# Altium schematic sheet SDP21_Daughter_Board_Schematic_REV1.SchDoc
size A4
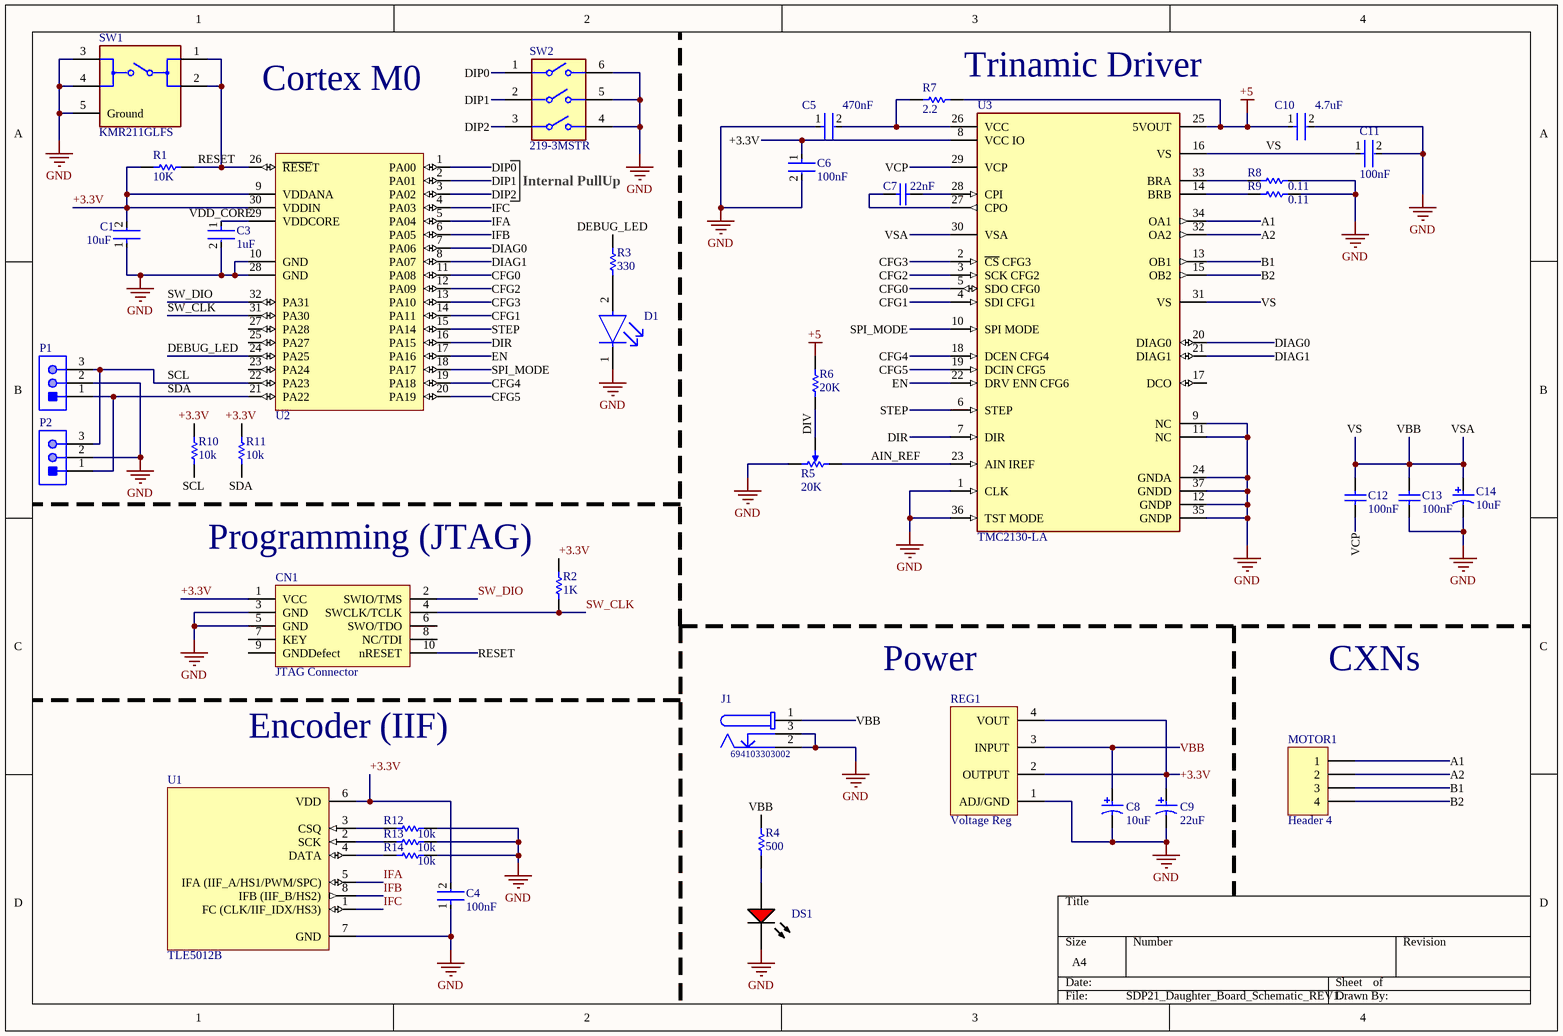
[diagram p0: SDP21_Daughter_Board_Schematic_REV1.SchDoc]

## Parts
C1  10uF  [FP-GRM188-0_1-e0_2_0_55-IPC_A]
C3  1uF  [FP-CC0603-DA-MFG]
C4  100nF  [FP-CGA3E-0_3-0_1-IPC_A]
C5  470nF  [FP-CC0603-DA-MFG]
C6  100nF  [FP-CGA3E-0_3-0_1-IPC_A]
C7  22nF  [CAPC1608X90X35ML10T15]
C8  10uF  [KEMT-A-3216-18-2_M]
C9  22uF  [AVX-TAJ-A-2_L]
C10  4.7uF  [FP-GRM188-0_15-IPC_C]
C11  100nF  [FP-CGA3E-0_3-0_1-IPC_A]
C12  100nF  [CAPC1608X90X35ML10T15]
C13  100nF  [CAPC1608X90X35ML10T15]
C14  10uF  [NIC-CAPA2-6.3X5.8_V]
CN1  JTAG Connector  [Header 5x2 - 50mil]
D1  APT1608LZGCK  [FP-APT1608LZGCK-MFG]  (value not drawn)
DS1  TLMS1100-GS08  [VISH-TLMX1100_V]  (value not drawn)
J1  694103303002  [694103303002]
MOTOR1  Header 4  [HDR1X4]
P1  B3B-PH-K-S(LF)(SN)  [JST-B3B-PH-K-S-3_V]  (value not drawn)
P2  B3B-PH-K-S(LF)(SN)  [JST-B3B-PH-K-S-3_V]  (value not drawn)
R1  10K  [RESC1609X55X30LL15T15]
R2  1K  [RESC1608X55X30LL20T20]
R3  330  [RESC1608X55X30ML15T15]
R4  500  [RESC1608X55X30ML15T15]
R5  20K  [BOUR-3313J-1_V]
R6  20K  [RESC1608X55X25LL10T15]
R7  2.2  [RESC1608X55X30ML15T15]
R8  0.11  [RESC3116X65X40ML10T20]
R9  0.11  [RESC3116X65X40ML10T20]
R10  10k  [RESC1608X55X30ML15T15]
R11  10k  [RESC1608X55X30ML15T15]
R12  10k  [RESC1608X55X30ML15T15]
R13  10k  [RESC1608X55X30ML15T15]
R14  10k  [RESC1608X55X30ML15T15]
REG1  Voltage Reg  [SOT223]
SW1  KMR211GLFS  [FP-KMR211GLFS-MFG]
SW2  219-3MSTR  [FP-219-3MSTR-MFG]
U1  TLE5012B  [PG-DSO-8]
U2  ATSAMD21E15B-AUT  [TQFP-32]  (value not drawn)
U3  TMC2130-LA  [FP-TMC2130-LA-IPC_C]

## Nets
+5: C10.1 R6.2 R7.2 U3.25(5VOUT)
GND: C1.1 C3.2 C4.1 C5.1 C6.2 C8.2 C9.2 C10.2 C11.2 C13.1 C14.2 CN1.3(GND) CN1.5(GND) D1.1(C) DS1.2(K) J1.2 J1.3 P1.2 P2.2 R5.3 R8.2 R9.2 R12.1 R13.1 R14.1 REG1.1(ADJ/GND) SW1.3 SW1.4 SW1.5(Ground) SW2.4 SW2.5 SW2.6 U1.7(GND) U2.10(GND) U2.28(GND) U3.1(CLK) U3.9(NC) U3.11(NC) U3.12(GNDP) U3.24(GNDA) U3.35(GNDP) U3.36(TST_MODE) U3.37(GNDD)
+3.3V: C1.2 C4.2 C6.1 C9.1 CN1.1(VCC) R1.1 R2.2 R10.2 R11.2 REG1.2(OUTPUT) REG1.4(VOUT) U1.6(VDD) U2.9(VDDANA) U2.30(VDDIN) U3.8(VCC_IO)
A1: MOTOR1.1 U3.34(OA1)
A2: MOTOR1.2 U3.32(OA2)
AIN_REF: R5.1 U3.23(AIN_IREF)
B1: MOTOR1.3 U3.13(OB1)
B2: MOTOR1.4 U3.15(OB2)
CFG0: U2.11(PA08) U3.5(SDO_CFG0)
CFG1: U2.14(PA11) U3.4(SDI_CFG1)
CFG2: U2.12(PA09) U3.3(SCK_CFG2)
CFG3: U2.13(PA10) U3.2(~{CS}_CFG3)
CFG4: U2.19(PA18) U3.18(DCEN_CFG4)
CFG5: U2.20(PA19) U3.19(DCIN_CFG5)
DEBUG_LED: R3.2 U2.24(PA25)
DIAG0: U2.7(PA06) U3.20(DIAG0)
DIAG1: U2.8(PA07) U3.21(DIAG1)
DIP0: SW2.1 U2.1(PA00)
DIP1: SW2.2 U2.2(PA01)
DIP2: SW2.3 U2.3(PA02)
DIR: U2.16(PA15) U3.7(DIR)
DIV: R5.2 R6.1
EN: U2.17(PA16) U3.22(DRV_ENN_CFG6)
IFA: U1.5(IFA_(IIF_A/HS1/PWM/SPC)) U2.5(PA04)
IFB: U1.8(IFB_(IIF_B/HS2)) U2.6(PA05)
IFC: U1.1(FC_(CLK/IIF_IDX/HS3)) U2.4(PA03)
RESET: CN1.10(nRESET) R1.2 SW1.1 SW1.2 U2.26(~{RESE}T)
SCL: P1.3 P2.3 R10.1 U2.22(PA23)
SDA: P1.1 P2.1 R11.1 U2.21(PA22)
SPI_MODE: U2.18(PA17) U3.10(SPI_MODE)
STEP: U2.15(PA14) U3.6(STEP)
SW_CLK: CN1.4(SWCLK/TCLK) R2.1 U2.31(PA30)
SW_DIO: CN1.2(SWIO/TMS) U2.32(PA31)
VBB: C8.1 C11.1 C12.2 C13.2 C14.1 J1.1 R4.2 REG1.3(INPUT) U3.16(VS) U3.30(VSA) U3.31(VS)  [also labelled VS, VSA]
VCP: C12.1 U3.29(VCP)
VDD_CORE: C3.1 U2.29(VDDCORE)
NetC5_2: C5.2 R7.1 U3.26(VCC)
NetC7_1: C7.1 U3.27(CPO)
NetC7_2: C7.2 U3.28(CPI)
NetD1_2: D1.2(A) R3.1
NetDS1_1: DS1.1(A) R4.1
NetR8_1: R8.1 U3.33(BRA)
NetR9_1: R9.1 U3.14(BRB)
NetR12_2: R12.2 U1.3(CSQ)
NetR13_2: R13.2 U1.2(SCK)
NetR14_2: R14.2 U1.4(DATA)

Not connected (* = marked no-connect by the designer): CN1 6(SWO/TDO) 7(KEY) 8(NC/TDI) 9(GNDDefect); U2 23(PA24) 25(PA27) 27(PA28); U3 17(DCO)

## Notes on the sheet
- Cortex M0
- (near R7) Trinamic Driver
- Internal PullUp
- Programming (JTAG)
- Power
- CXNs
- Encoder (IIF)

## Library data of the parts
C1 = CMP-2006-02792-2: Chip Multilayer Ceramic Capacitors for General Purpose, 0603, 10uF, X5R, 15%, 20%, 6.3V; Packaging: Tape and Reel; Voltage Rating (DC): 6.3V; Width: 0.031inch; Termination: SMD/SMT; Dielectric: X5R; Package Quantity: 4000; Voltage Rating: 6.3V; Capacitance: 10uF; Case/Package: 0603; Min Operating Temperature: -55°C; Voltage: 6.3V; Length: 1.6mm; Thickness: 0.035inch; Lead Free: Lead Free; Depth: 0.8mm; Case Code (Imperial): 0603; Max Operating Temperature: 85°C; Material: Ceramic; Height: 0.8mm; Tolerance: 20%; Mount: Surface Mount; REACH SVHC: No SVHC; Radiation Hardening: No; Case Code (Metric): 1608
C3 = CMP-03422-000924-1: CAP CER 1UF 16V X7R 0603; Manufacturer: YAGEO; Manufacturer Part Number: CC0603KRX7R7BB105; Tolerance: 0.1; Temperature Coefficient: 15%; Material: Ceramic; Package: CC0603-DA; RoHS: TRUE; Device Class L2: Capacitors; Temperature Characteristic: X7R; Temperature: -55°C to +125°C; Temperature Range Low: -55°C; Automotive: No; ComponentLink2Description: Datasheet; Value: 1 uF; Lead Free: Yes; Capacitance: 1 uF; ComponentLink2URL: http://www.yageo.com/documents/recent/UPY-GPHC_X7R_6.3V-to-50V_18.pdf; Device Class L1: Passive Components; Voltage: 16 V; Octopart: https://octopart.com/cc0603krx7r7bb105-yageo-42271928; Category: Cap; Digikey Description: CAP CER 1UF 16V X7R 0603; Footprint Url: http://www.yageo.com/exep/pages/download/literatures/UPY-C_GEN_24.pdf; Height: 0.9mm; Voltage Rating: 16 V; Temperature Range High: +125°C; Mouser Description: Multilayer Ceramic Capacitor, CC Series, 1 - F, - 10%, X7R, 16 V, 0603 [1608 Metric]; Device Class L3: Ceramic Capacitors
C4 = CMP-2000-07546-2: Cap Ceramic 100nF 50V X7R 10% Pad SMD 0603 +125°C Automotive T/R; Radiation Hardening: No; Composition: Ceramic; Width: 0.8mm; Length: 1.6mm; Capacitance: 100nF; Voltage: 50V; Tolerance: 10%; Case Code (Imperial): 0603; Min Operating Temperature: -55°C; Packaging: Tape and Reel; Package Quantity: 1; Voltage Rating: 50V; Mount: Surface Mount; Lead Free: Lead Free; Depth: 0.8mm; Termination: SMD/SMT; Case Code (Metric): 1608; Thickness: 0.035inch; Height: 0.8mm; Dielectric: X7R; Weight: 7.1E-05oz; Voltage Rating (DC): 50V; REACH SVHC: No SVHC; Case/Package: 0603; Max Operating Temperature: 125°C; Ratings: AEC-Q200
C5 = CMP-1035-02696-2: CAP CER 0.47UF 10V X7R 0603; Manufacturer Part Number: CC0603KRX7R6BB474; Manufacturer: YAGEO; Tolerance: 0.1; Temperature Coefficient: 15%; Material: Ceramic; RoHS: TRUE; Device Class L1: Passive Components; Digikey Description: CAP CER 0.47UF 10V X7R 0603; Mouser Description: Multilayer Ceramic Capacitors MLCC - SMD/SMT 470nF 10V X7R 10%; ComponentLink2URL: http://www.yageo.com/documents/recent/UPY-GPHC_X7R_6.3V-to-50V_18.pdf; Automotive: No; Lead Free: Yes; Package: CC0603-DA; Voltage: 10 V; Temperature: -55°C to +125°C; Device Class L2: Capacitors; Octopart: https://octopart.com/cc0603krx7r6bb474-yageo-9287391; Voltage Rating: 10 V; Temperature Range High: +125°C; Value: 470 nF; Category: Cap; Capacitance: 470 nF; Device Class L3: Ceramic Capacitors; Temperature Range Low: -55°C; Footprint Url: http://www.yageo.com/exep/pages/download/literatures/UPY-C_GEN_24.pdf; Height: 0.9mm; ComponentLink2Description: Datasheet; Temperature Characteristic: X7R
C6 C11 = CMP-2000-04983-3: Cap Ceramic 100nF 100V X7S 10% Pad SMD 0603 +125°C Automotive T/R; Case Code (Metric): 1608; Termination: SMD/SMT; Capacitance: 100nF; Length: 1.6mm; Packaging: Tape and Reel; Weight: 7.1E-05oz; Ratings: AEC-Q200; Voltage Rating: 100V; Case/Package: 0603; Mount: Surface Mount; Radiation Hardening: No; Height: 0.8mm; Tolerance: 10%; REACH SVHC: No SVHC; Voltage Rating (DC): 100V; Dielectric: X7S; Case Code (Imperial): 0603; Depth: 0.8mm; Thickness: 0.035inch; Package Quantity: 1; Max Operating Temperature: 125°C; Lead Free: Lead Free; Width: 0.031inch; Min Operating Temperature: -55°C; Composition: Ceramic
C7 = CMP-2006-02910-1: Manufacturer: Murata; Part Number: GRM188R71H223KA01D
C8 = CMP-2000-05172-1: Capacitor, Tantalum, 10 uF, +/- 10%, 10 V, -55 to 125 degC, 2-Pin SMD (1206), RoHS, Tape and Reel; Manufacturer Size Code: A; Manufacturer: Kemet; Type: Molded; Online Catalog: T491Series; Other Names: 399-3684-2; Voltage - Rated: 10V; Lifetime @ Temp.: 2000Hrs@85degC; Product Training Modules: CapacitorBasics-TypicalUsesforCapacitorsDeratingGuidelinesforSurfaceMountTantalumCapacitors; ESR (Equivalent Series Resistance): 3.8Ohm; Capacitance: 10µF; Catalog Drawings: T49x,T5xxSeries_A-side1T49x,T5xxSeries_A,B-side2T49x,T5xxSeries_A,SBottom; Family: TantalumCapacitors; Manufacturer URL: http://www.kemet.com/; Datasheet URL: http://www.farnell.com/datasheets/1824869.pdf; Package Reference: 1206; Packaging: Tape&Reel(TR); Series: T491; Operating Temperature: -55degC~125degC; Mounting Type: SurfaceMount; Height - Seated (Max): 0.071"(1.80mm); Package / Case: 1206(3216Metric); Package Description: 2-Pin Surface Mount Device, Body 3.2 x 1.6 mm; Features: GeneralPurpose; Tolerance: ±10%; Lead Spacing: -; Size / Dimension: 0.126"Lx0.063"W(3.20mmx1.60mm); Standard Package: 2,000; Datasheet Version: Apr-14; Category: Capacitors
C9 = CMP-2000-07524-1: Chip Capacitor, 22 uF, +/- 10%, 10 V, -55 to 125 degC, 1206 (3216 Metric), RoHS, Tape and Reel; Manufacturer: AVX; Leakage Current: 2.2uA; Polarity: Polar; Dielectric Material: Tantalum; Voltage Rating (DC): 10V; Dissipation Factor: 8%; ESR (Equivalent Series Resistance): 3Ohm; Height - Seated (Max): 0.071inch; Number of Pins: 2; Termination: SMD/SMT; Package Quantity: 1; Datasheet Version: 09/2017; Packaging: TapeandReel; Case/Package: 1206; Lead Free: LeadFree; Manufacturer URL: http://www.avx.com/; RoHSCompliant: True; Mount: PCB; Package Reference: TAJ-A-2; Width: 1.6mm; Height: 1.6mm; Radiation Hardening: No; Lead Pitch: 1.1mm; Tolerance: 10%; REACH SVHC: NoSVHC; Depth: 1.6mm; Package Description: 2-Pin Surface Mount Device, Body 3.2 x 1.65 mm; Case Code (Metric): 3216; Case Code (Imperial): 1206; Mounting Technology: SurfaceMount; Datasheet URL: http://datasheets.avx.com/TAJ.pdf; Capacitance: 22uF; Voltage: 10V; Length: 3.2mm; Max Operating Temperature: 125degC; Voltage Rating: 10V; Min Operating Temperature: -55degC
C10 = CMP-2006-02523-2: Chip Multilayer Ceramic Capacitors for General Purpose, 0603, 4.7uF, X5R, 15%, 10%, 25V; Case Code (Metric): 1608; Max Operating Temperature: 85°C; REACH SVHC: No SVHC; Voltage Rating: 25V; Dielectric: X5R; Packaging: Cut Tape; Width: 0.031inch; Min Operating Temperature: -55°C; Lead Free: Lead Free; Capacitance: 4.7uF; Height: 0.8mm; Case Code (Imperial): 0603; Length: 1.6mm; Voltage Rating (DC): 25V; Case/Package: 0603; Voltage: 25V; Tolerance: 10%; Thickness: 0.031inch; Mount: Surface Mount; Material: Ceramic; Package Quantity: 4000; Depth: 0.8mm
C12 C13 = CMP-2100-03643-1: Chip Capacitor, 0.1 uF, +/- 10%, 50 V, -55 to 125 degC, 0603 (1608 Metric), RoHS, Tape and Reel; Manufacturer: Murata; Dielectric Material: Ceramic; Voltage Rating: 50V; Dielectric: X7R; Insulation Resistance: 10GR; Case Code (Metric): 1608; Lead Free: LeadFree; Depth: 0.8mm; Number of Pins: 2; Radiation Hardening: No; Case/Package: 0603; Manufacturer URL: http://www.murata.com/; Packaging: TapeandReel; Length: 1.6mm; Contact Plating: Tin; Datasheet URL: http://psearch.en.murata.com/capacitor/product/GRM188R71H104KA93%23.pdf; Tolerance: 10%; Case Code (Imperial): 0603; Min Operating Temperature: -55degC; RoHSCompliant: true; Capacitance: 100nF; Voltage: 50V; Termination: SMD/SMT; Mount: SurfaceMount; Material: Ceramic; Package Quantity: 1; Height: 0.8mm; Thickness: 0.035inch; REACH SVHC: NoSVHC; Max Operating Temperature: 125degC; Width: 0.8mm; Package Reference: 0603; Voltage Rating (DC): 50V; Datasheet Version: 42675.0; Package Description: 2-Pin Surface Mount Device, Body 1.6 x 0.8 mm
C14 = CMP-0687-00043-1: Aluminum Electrolytic Capacitor, UD Series, Low Impedance, 10 uF, 50 V, + / - 20%, -55 to 105 degC, Chip Type, 6.3 x 5.8 mm D x L, Pb-Free, Reel; Manufacturer: Nichicon; PartNumber: UUD1H100MCL1GS; Impedance: 0.88 Ohm; Rated Voltage: 50 V; Endurance Time: 2000 h; Rated Ripple Current (at 100kHz): 165 mA; Packing: Dia382mm Reel; Tolerance Rated Capacitance: -20 to 20%; ComponentLink2Description: Datasheet; Length: 5.8 mm; ComponentLink2URL: http://products.nichicon.co.jp/en/pdf/XJA043/e-ud.pdf; RoHS: TRUE; DatasheetVersion: 08/2012; ComponentLink3URL: http://products.nichicon.co.jp/en/pdf/XJA043/e-ud.pdf; ComponentLink3Description: Package Specification; ComponentLink1Description: Manufacturer URL; Mounting Technology: Surface Mount; ComponentLink1URL: http://www.nichicon.co.jp/; PackageDescription: 2-Pin Surface Mount Device, Diameter 6.3 mm, Height 5.8 mm, Pitch 5.4 mm; Rated Capacitance: 10 uF; PackageReference: CAPAE-D6.3H5.8; Diameter: 6.3 mm
D1 = CMP-44529-000040-1: LED GREEN CLEAR 2SMD; Dominant Wavelength: 525nm; Forward Voltage: 2.65V; Luminous Intensity: 50mcd; Test Current: 2mA; Viewing Angle: 120°; Lens Color: Colorless; Width: 0.8mm; Mount: Surface Mount; Lens Transparency: Clear; Length: 1.6mm; Packaging: Cut Tape; Case Code (Metric): 1608; Height: 0.75mm; Case/Package: 0603; Case Code (Imperial): 0603; Color: Green
DS1 = CMP-1666-00027-1: LED, RED, 2.1 V, -40 to 100 degC, 2-Pin SMD (0603), RoHS, Tape and Reel; Type (Capacitors): C0G; Resistance: 100000000000 Ohm; Capacitance: 12 pF; Voltage Rating: 50 V; Tolerance: 5%; Min Operating Temperature: -55degC; REACH SVHC: No SVHC; ComponentLink2Description: Datasheet; ComponentLink1URL: http://www.vishay.com/; Width: 0.8 mm; Package Quantity: 4000; PackageReference: TLMX1100; ComponentLink2URL: http://www.vishay.com/docs/83173/tlmb1100.pdf; Case/Package: 0603; Case Code (Metric): 1608; Packaging: Tape and Reel; Pins: 2; ComponentLink1Description: Manufacturer URL; Max Operating Temperature: 125degC; Height: 0.8 mm; Length: 1.6 mm; Mount: Surface Mount; PackageDescription: 2-Pin Surface Mount Device, Body 1.6 x 0.8 mm; DatasheetVersion: Rev. 2.7, 03/2016; Case Code (Imperial): 0603; Voltage Rating (DC): 50 V; RoHSCompliant: True; Radiation Hardening: No
J1 = CMP-1502-00185-1: DC Power Jack Connector WR-DC, Male, Right Angled, THT, 2 A, 30 V; Manufacturer: Wurth Elektronik; Plug Inner Diameter: 1.35mm; Working Voltage: 30V; Plug Outer Diameter: 3.5mm; Rated Current: 2A; Opening Diameter: 4.2mm; Operating Temperature: -40to85degC; Package Reference: 694103303002; Manufacturer URL: http://www.we-online.de; Part Number: 694103303002; Datasheet URL: http://katalog.we-online.de/em/datasheet/6941xx303002.pdf; Gender: Male; Mounting Technology: THT; Packaging: Bag; Publisher: WurthElektronik; Orientation: RightAngled
MOTOR1 = Header 4: Header, 4-Pin; LatestRevisionDate: 17-Jul-2002; LatestRevisionNote: Re-released for DXP Platform.; Publisher: Altium Limited
P1 P2 = CMP-2000-05164-1: Male Header, Pitch 2 mm, 1 x 3 Position, Height 6 mm, Tail Length 3.4 mm, -25 to 85 degC, RoHS, Bulk; Manufacturer: JST; Style/Orientation: StraightHeader/Plug; Pitch: 2mm; No of Positions: 3; Termination: Crimp; Manufacturer URL: http://www.jst.com/home2.html; Datasheet Version: Oct-06; Type: ShroudedHeader; Datasheet URL: https://datasheet.ciiva.com/11746/0900766b80826550-11746939.pdf
R1 = CMP-1012-00623-3: Chip Resistor, 10 KOhm, +/- 1%, 0.1 W, -55 to 155 degC, 0603 (1608 Metric), RoHS, Tape and Reel; Manufacturer: Panasonic; Voltage Rating: 75V; Case\/Package: 0603; Power Rating: 100mW; Resistance: 10KOhm; Temperature Coefficient: 100ppm\/degreesC; Number of Pins: 2; Package Reference: 603; Depth: 0.8mm; Mount: SurfaceMount; Package Description: 2-Pin Surface Mount Device, Body 1.6 x 0.85 mm; Datasheet Version: 02/2017; Length: 1.6mm; Lead Free: LeadFree; Height: 0.45mm; Number of Terminations: 2; Max Power Dissipation: 100mW; Min Operating Temperature: -55degC; Datasheet URL: https://industrial.panasonic.com/cdbs/www-data/pdf/RDA0000/AOA0000C304.pdf; Termination: SMD/SMT; Case Code (Metric): 1608; Case Code (Imperial): 0603; Tolerance: 1%; Max Operating Temperature: 155degC; RoHSCompliant: true; Voltage Rating (DC): 75V; Radiation Hardening: No; Packaging: TapeandReel; Composition: ThickFilm; Mounting Technology: SurfaceMount; Manufacturer URL: http://www.panasonic.com/; Width: 0.031inch; REACH SVHC: NoSVHC; Contact Plating: Tin; Military Standard: Not; Package Quantity: 1
R2 = CMP-2000-00873-1: Manufacturer: Panasonic; Part Number: ERA3AEB102V
R3 R4 R7 R10-R14 = CMP-2000-00866-1: Manufacturer: Panasonic; Part Number: ERJ-3RSJR10V
R5 = CMP-2000-05586-1: 3 mm Trimpot(R) Trimming Potentiometer, 20 KOhm, +/- 20%, 0.125 W, -55 to 125 degC, 3-Pin SMD, RoHS, Tape and Reel; Manufacturer: Bourns; Insulation Resistance: 100Megohms(Min.)@500VDC; Rotational Life: 100Cycles; Resolution: Infinite; Brand/Series: Trimpot®3313-SealedSeries; Temperature, Operating, Maximum: +125°C; Resistance: 20Kilohms; Resistance, Insulation: 100Megohms; Material, Element: Cermet; Standards: RoHSCompliant; Dielectric Strength: 500VAC; Load Life: 1000hr@0.125W,70°C; Torque: 50g-cm; Temperature Coefficient: ±100ppm/°C; Number of Turns: 1; Power, Rating: 0.125W; Angle, Mechanical: 250°; Temperature, Operating, Minimum: -55°C; Package Reference: 3313J-1; Dimensions: 0.126"Lx0.138"Wx0.087"H; Tolerance: ±20%; Type: Trimmer; Package Description: 3-Pin Surface Mount Device, Body 3.5 x 3.2 mm, Pitch 1.15 mm; Mounting Technology: SurfaceMount; Datasheet URL: http://www.bourns.com/docs/Product-Datasheets/3313.pdf; Mounting Type: SurfaceMount; Manufacturer URL: http://www.bourns.com/; Datasheet Version: 05/2016; Termination: SMD
R6 = CMP-2000-06932-1: Chip Resistor, 20 KOhm, +/- 1%, 0.1 W, -55 to 155 degC, 0603 (1608 Metric), RoHS, Tape and Reel; Manufacturer: Yageo; Power Rating: 100mW; Temperature Coefficient: 100PPM/C; Resistance: 20kOhms; Voltage Rating: 50V; Case Code - in: 0603; Packaging: Reel; Datasheet Version: Rev. 7, 05/2017; Series: RC; Mounting Technology: SurfaceMount; Product: ThickFilmResistorsGeneralPurpose; Manufacturer URL: http://www.yageo.com/; Package Description: 2-Pin Surface Mount Device, Body 1.6 x 0.8 mm; Package Reference: 0603; Termination Style: SMD/SMT; Case Code - mm: 1608; Operating Temperature Range: -55Cto+155C; Datasheet URL: http://www.yageo.com/documents/recent/PYu-RC_Group_51_RoHS_L_7.pdf; Tolerance: 1%
R8 R9 = CMP-2003-04052-1: Part Number: RL1206FR-7W0R56L; Manufacturer: Yageo
SW1 = CMP-10040-000023-1: SWITCH TACTILE SPST-NO 0.05A 32V; Switch Function: Off-Mom; Throw Configuration: SPST; Switch Travel: 0.2mm; Current Rating: 50mA; Illumination Type: Non-Illuminated; Actuator Length: 0.5mm; Power Rating: 1W; Operating Force: 1.2N; Actuator Type: Standard; Mechanical Life: 200000Cycles; REACH SVHC: No SVHC; Voltage Rating (DC): 32V; Length: 2.8mm; Min Operating Temperature: -40°C; Mount: Surface Mount; Max Voltage Rating (DC): 32V; Width: 2.8mm; Depth: 4.6mm; Packaging: Tape and Reel; Lead Free: Lead Free; Contact Material: Silver; Termination: Gull Wing; Package Quantity: 1; Contact Current Rating: 50mA; Orientation: Straight; Max Operating Temperature: 85°C; Radiation Hardening: No; Max Current Rating: 50mA; Contact Plating: Silver
SW2 = CMP-07018-000004-1: SWITCH SLIDE DIP SPST 100MA 20V; Washable: Yes; Mechanical Life: 2000Cycles; Number of Positions: 3; Pitch: 0.1inch; Actuator Type: Slide (Standard); Max Operating Temperature: 85°C; Voltage Rating (DC): 20V; Termination: Gull Wing; Length: 0.358inch; Min Operating Temperature: -55°C; Orientation: Straight; Mount: Surface Mount; Package Quantity: 1000; Current Rating: 100mA; Electrical Life: 2000Cycles; Max Current Rating: 100mA; Throw Configuration: SPST; Contact Material: Copper; Packaging: Tape and Reel; Contact Plating: Gold; Lead Free: Lead Free; Max Voltage Rating (DC): 20V
U1 = TLE5012B: TLE5012B GMR-Based Angle Sensor PG-DSO-8
U2 = ATSAMD21E15B-AUT: IC MCU 32BIT 32KB FLASH 32TQFP
U3 = CMP-237673-000001-1: IC MTR DRV BIPOLAR 5.5-46V 36QFN; Manufacturer: Trinamic; Number Of Outputs: 1; Max Supply Voltage: 46V; Nominal Supply Current: 2-19mA; Min Supply Voltage: 3V; Max Junction Temp: +125°C; Standoff Height: 0mm; Output Voltage: 4.75-46V; Motor Type: Stepper; Max Power Dissipation: 2.6W; Output Current: 2.5A; Temperature Range Low: -40°C; ComponentLink2URL: https://www.trinamic.com/fileadmin/assets/Products/ICs_Documents/TMC2130_datasheet_Rev1.11.pdf; Digikey Description: IC MTR DRV BIPOLAR 5.5-46V 36QFN; Device Class L3: Motor Drivers; Temperature Range High: +125°C; Octopart: https://octopart.com/tmc2130-la-trinamic-61933290; Device Class L2: Power Management ICs; Category: IC; Package: 0; Lead Free: Yes; ComponentLink2Description: Datasheet; RoHS: TRUE; Ipc Land Pattern Name: QFN50P500X600X85-36; Automotive: No; Height: 0.9mm; Device Class L1: Integrated Circuits (ICs); Manufacturer Part Number: TMC2130-LA; Temperature: -40°C to +125°C